# EAGLE schematic control (EAGLE 9.6.2)

## Sheet 1 of 3: COVER
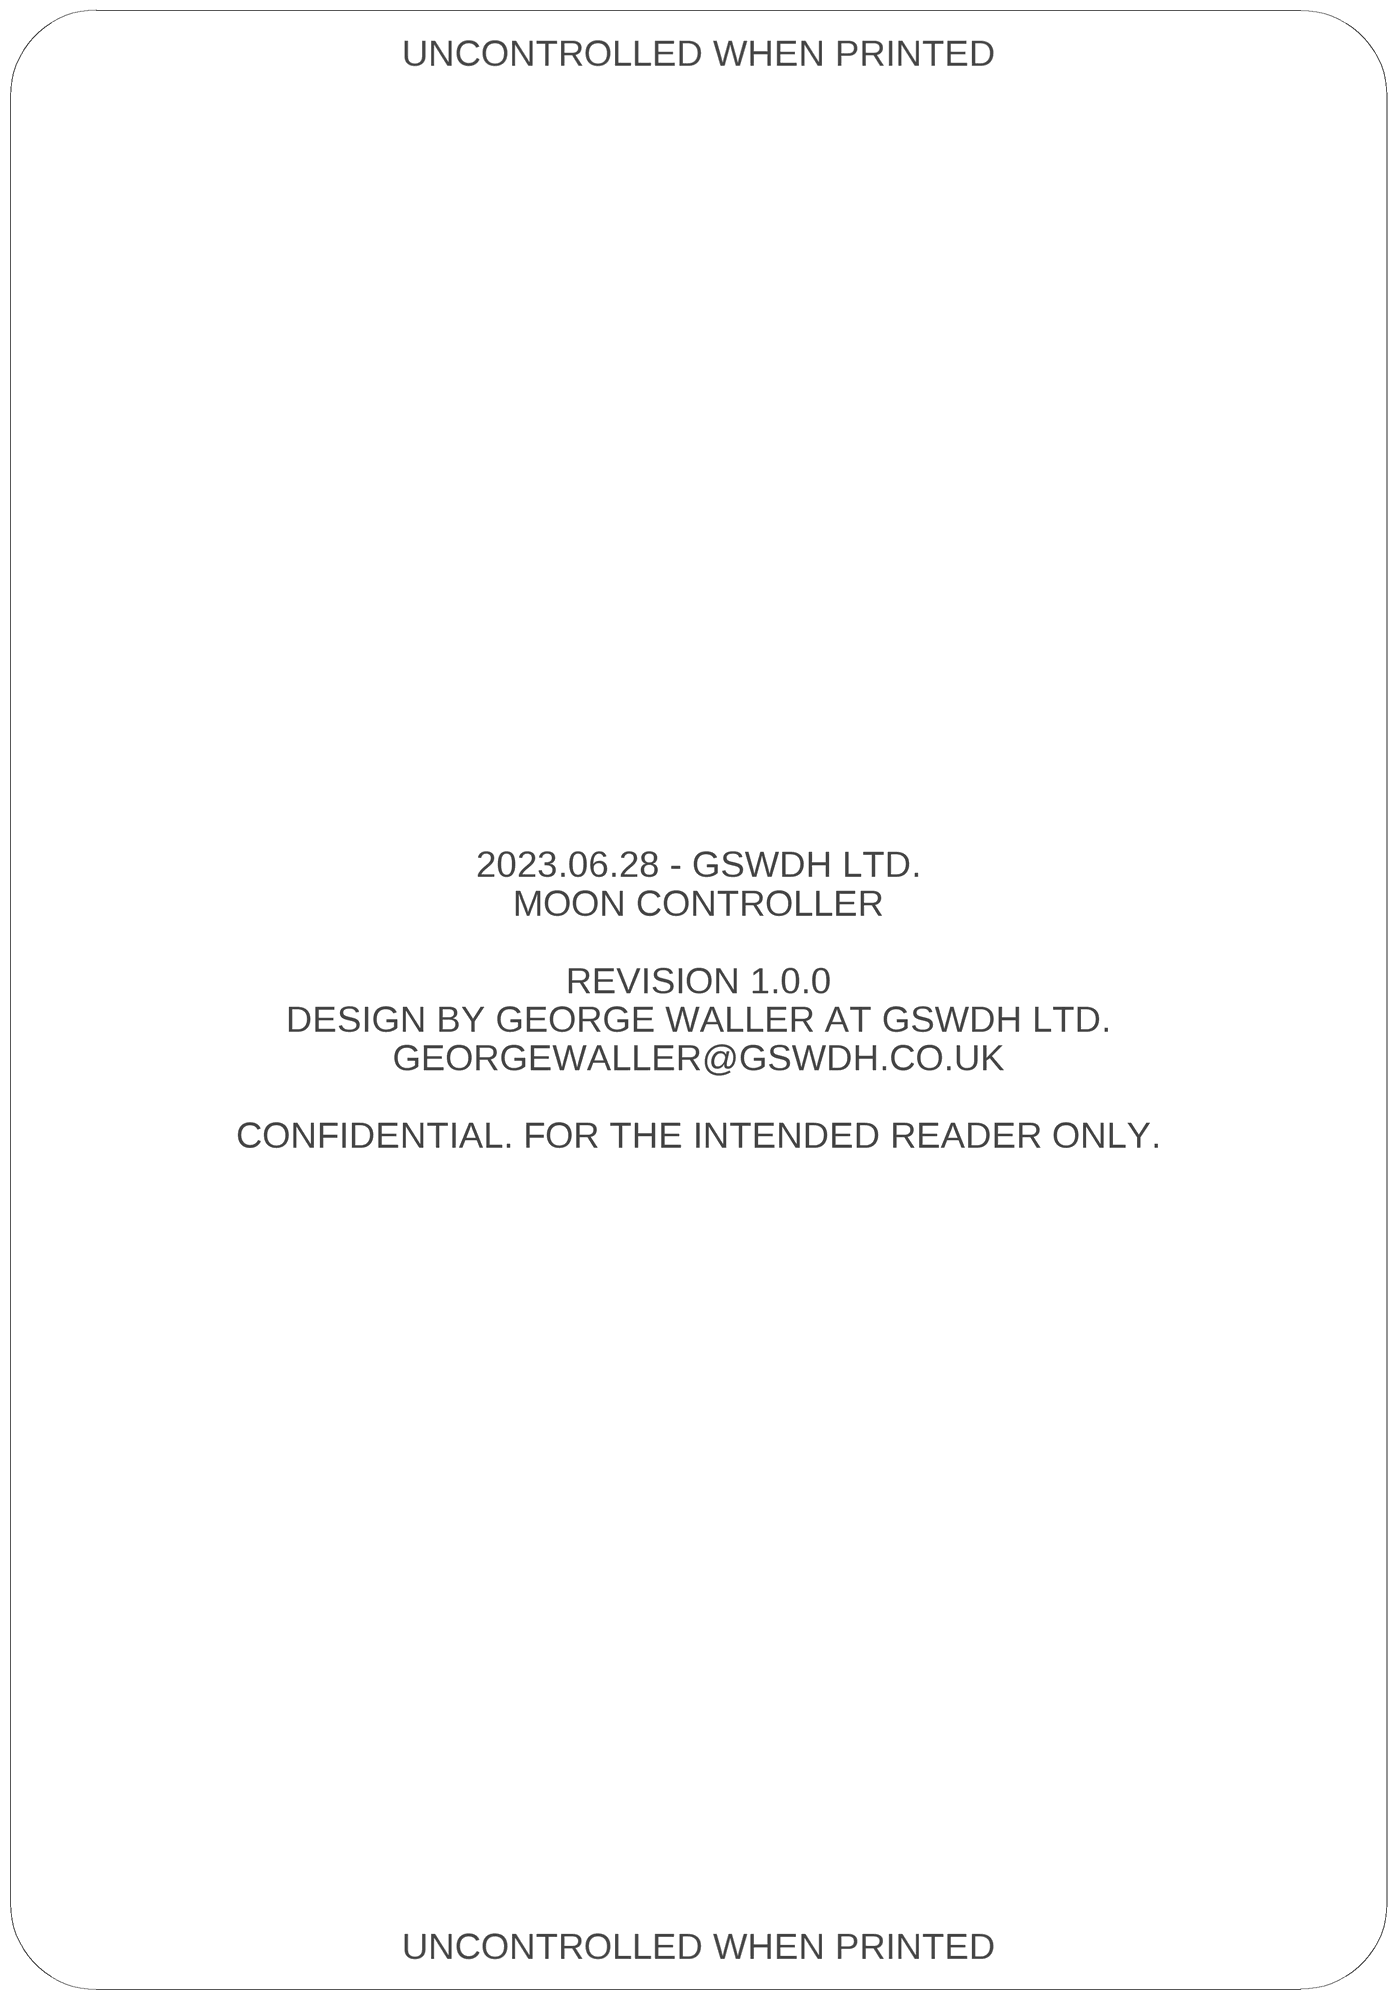
[diagram p0: schematic, sheet 1]

### Notes on the sheet
- UNCONTROLLED WHEN PRINTED
- 2023.06.28 - GSWDH LTD.
  MOON CONTROLLER
  
  REVISION 1.0.0
  DESIGN BY GEORGE WALLER AT GSWDH LTD.
  GEORGEWALLER@GSWDH.CO.UK
  
  CONFIDENTIAL. FOR THE INTENDED READER ONLY.
- UNCONTROLLED WHEN PRINTED

## Sheet 2 of 3: FPGA
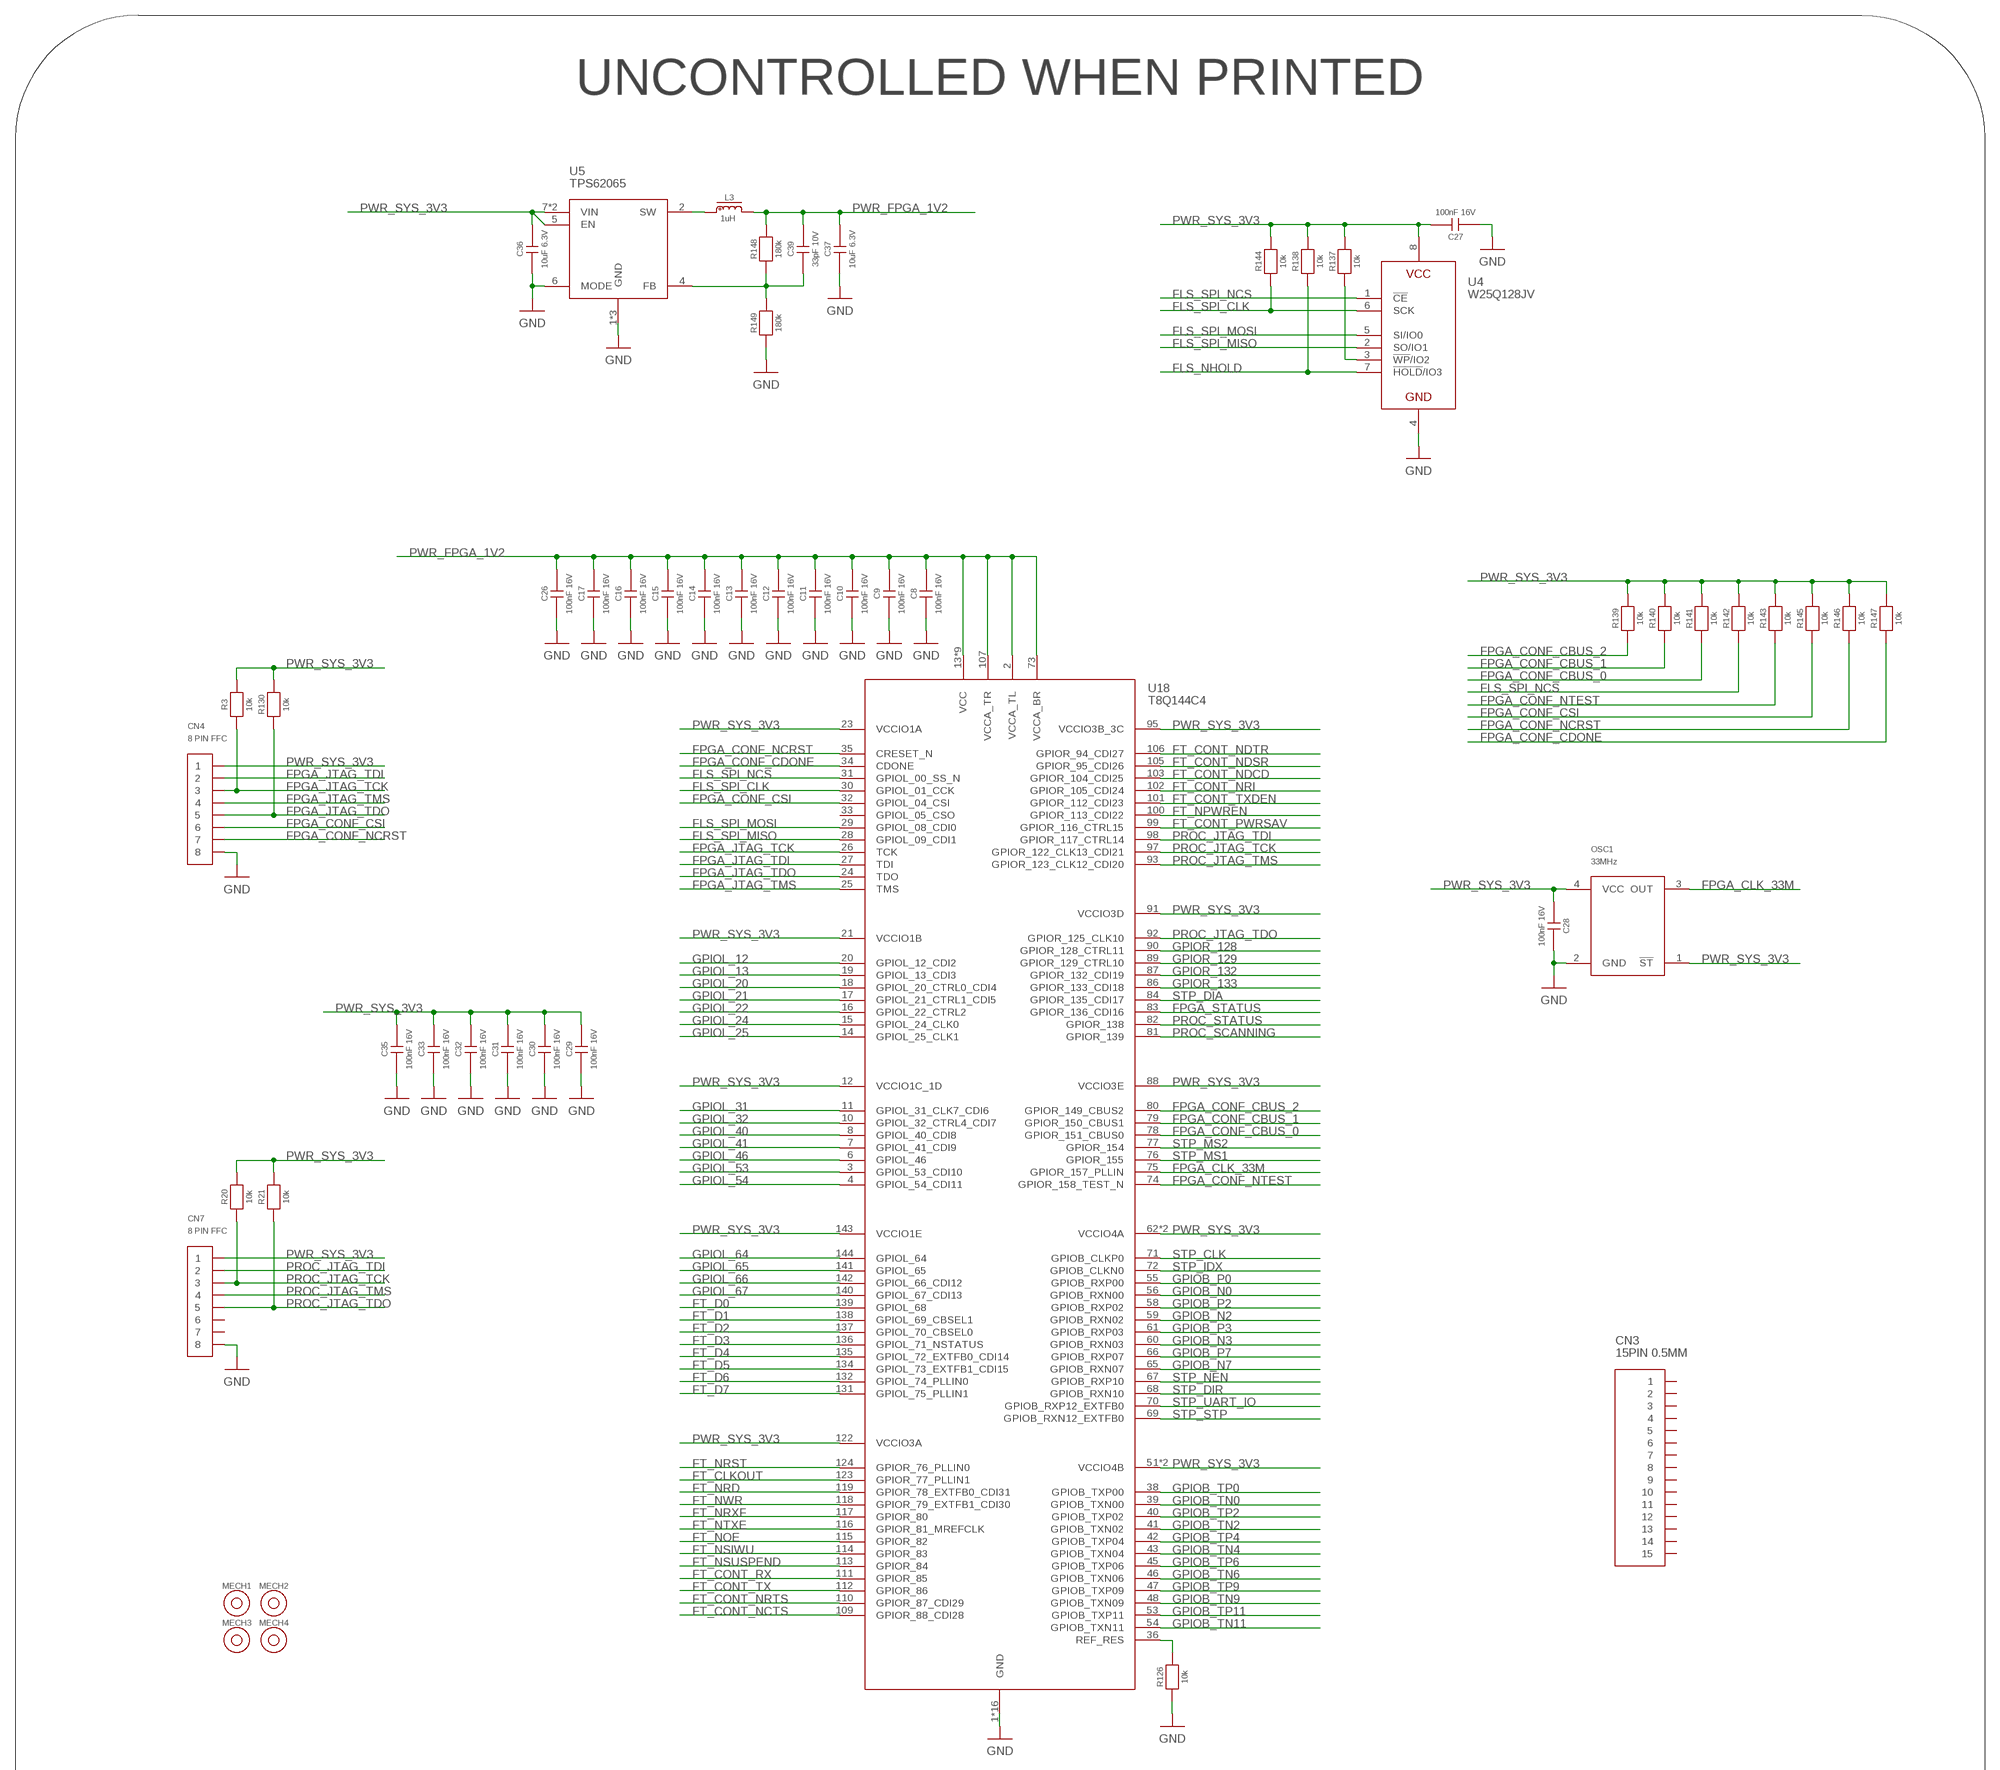
[diagram p1: schematic, sheet 2, part 1 of 2]
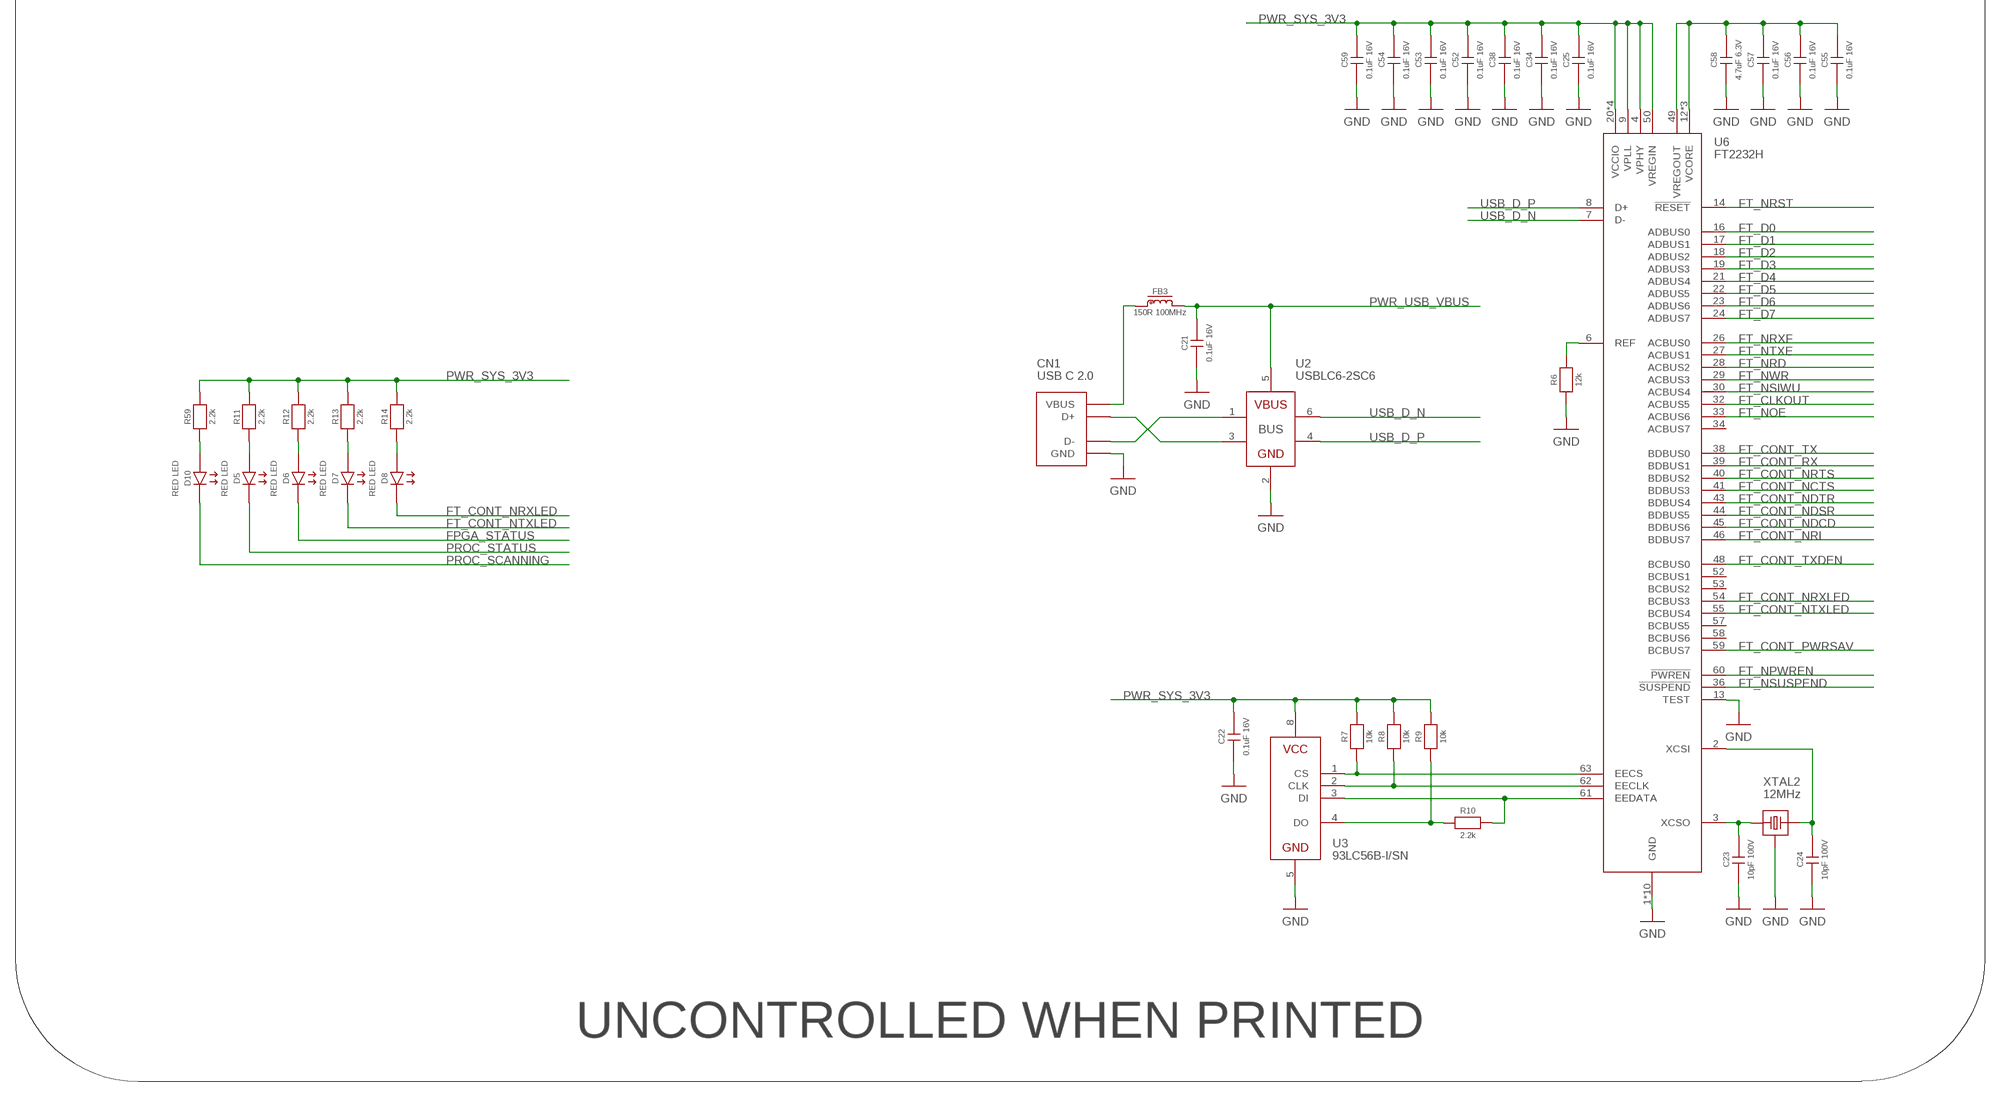
[diagram p2: schematic, sheet 2, part 2 of 2]

### Parts
C8  100nF 16V  CL10B104KO8WPNC  [0603]
C9  100nF 16V  CL10B104KO8WPNC  [0603]
C10  100nF 16V  CL10B104KO8WPNC  [0603]
C11  100nF 16V  CL10B104KO8WPNC  [0603]
C12  100nF 16V  CL10B104KO8WPNC  [0603]
C13  100nF 16V  CL10B104KO8WPNC  [0603]
C14  100nF 16V  CL10B104KO8WPNC  [0603]
C15  100nF 16V  CL10B104KO8WPNC  [0603]
C16  100nF 16V  CL10B104KO8WPNC  [0603]
C17  100nF 16V  CL10B104KO8WPNC  [0603]
C21  0.1uF 16V  0603YC104JAZ2A  [0603]
C22  0.1uF 16V  0603YC104JAZ2A  [0603]
C23  10pF 100V  06031A100B4T2A  [0603]
C24  10pF 100V  06031A100B4T2A  [0603]
C25  0.1uF 16V  0603YC104JAZ2A  [0603]
C26  100nF 16V  CL10B104KO8WPNC  [0603]
C27  100nF 16V  CL10B104KO8WPNC  [0603]
C28  100nF 16V  CL10B104KO8WPNC  [0603]
C29  100nF 16V  CL10B104KO8WPNC  [0603]
C30  100nF 16V  CL10B104KO8WPNC  [0603]
C31  100nF 16V  CL10B104KO8WPNC  [0603]
C32  100nF 16V  CL10B104KO8WPNC  [0603]
C33  100nF 16V  CL10B104KO8WPNC  [0603]
C34  0.1uF 16V  0603YC104JAZ2A  [0603]
C35  100nF 16V  CL10B104KO8WPNC  [0603]
C36  10uF 6.3V  CL10A106KQ8NNWC  [0603]
C37  10uF 6.3V  CL10A106KQ8NNWC  [0603]
C38  0.1uF 16V  0603YC104JAZ2A  [0603]
C39  33pF 10V  C0603C330J8GAC7867  [0603]
C52  0.1uF 16V  0603YC104JAZ2A  [0603]
C53  0.1uF 16V  0603YC104JAZ2A  [0603]
C54  0.1uF 16V  0603YC104JAZ2A  [0603]
C55  0.1uF 16V  0603YC104JAZ2A  [0603]
C56  0.1uF 16V  0603YC104JAZ2A  [0603]
C57  0.1uF 16V  0603YC104JAZ2A  [0603]
C58  4.7uF 6.3V  06036D475KAT4A  [0603]
C59  0.1uF 16V  0603YC104JAZ2A  [0603]
CN1  USB C 2.0  MC-107D  [MC-107D]
CN3  15PIN 0.5MM  SFV15R-1STE1HLF  [SFV15R-1STE1HLF]
CN4  8 PIN FFC  SFV8R-1STBE1HLF  [SFV8R-1STBE1HLF]
CN7  8 PIN FFC  SFV8R-1STBE1HLF  [SFV8R-1STBE1HLF]
D5  RED LED  150060RS75000  [0603_POLAR]
D6  RED LED  150060RS75000  [0603_POLAR]
D7  RED LED  150060RS75000  [0603_POLAR]
D8  RED LED  150060RS75000  [0603_POLAR]
D10  RED LED  150060RS75000  [0603_POLAR]
FB3  150R 100MHz  ILB1206ER151V  [1206]
L3  1uH  CIGT252010EH1R0MNE  [1008]
MECH1  6mm x 3mm  MOUNTHOLE  [MOUNTHOLE_6X3]
MECH2  6mm x 3mm  MOUNTHOLE  [MOUNTHOLE_6X3]
MECH3  6mm x 3mm  MOUNTHOLE  [MOUNTHOLE_6X3]
MECH4  6mm x 3mm  MOUNTHOLE  [MOUNTHOLE_6X3]
OSC1  33MHz  KC2016Z33.0000C15XXK  [KC2016Z]
R3  10k  ERJ3EKF1002V  [0603]
R6  12k  CRCW060312K0FKEA  [0603]
R7  10k  ERJ3EKF1002V  [0603]
R8  10k  ERJ3EKF1002V  [0603]
R9  10k  ERJ3EKF1002V  [0603]
R10  2.2k  CRCW06032K20FKEA  [0603]
R11  2.2k  CRCW06032K20FKEA  [0603]
R12  2.2k  CRCW06032K20FKEA  [0603]
R13  2.2k  CRCW06032K20FKEA  [0603]
R14  2.2k  CRCW06032K20FKEA  [0603]
R20  10k  ERJ3EKF1002V  [0603]
R21  10k  ERJ3EKF1002V  [0603]
R59  2.2k  CRCW06032K20FKEA  [0603]
R126  10k  ERJ3EKF1002V  [0603]
R130  10k  ERJ3EKF1002V  [0603]
R137  10k  ERJ3EKF1002V  [0603]
R138  10k  ERJ3EKF1002V  [0603]
R139  10k  ERJ3EKF1002V  [0603]
R140  10k  ERJ3EKF1002V  [0603]
R141  10k  ERJ3EKF1002V  [0603]
R142  10k  ERJ3EKF1002V  [0603]
R143  10k  ERJ3EKF1002V  [0603]
R144  10k  ERJ3EKF1002V  [0603]
R145  10k  ERJ3EKF1002V  [0603]
R146  10k  ERJ3EKF1002V  [0603]
R147  10k  ERJ3EKF1002V  [0603]
R148  180k  CRCW0603180KFKEA  [0603]
R149  180k  CRCW0603180KFKEA  [0603]
U2  USBLC6-2SC6  [SOT23-6]
U3  93LC56B-I/SN  [SO8]
U4  W25Q128JV  W25Q128JVSIQ  [SO8-208MIL]
U5  TPS62065  TPS62065DSGR  [WSON8]
U6  FT2232H  [QFN64]
U18  T8Q144C4  [QFP144]
XTAL2  12MHz  ABM8-12.000MHZ-B2-T  [3.2X3.5SMD]

### Nets
FLS_NHOLD: R138.1 U4.7(!HOLD!/IO3)
FLS_SPI_CLK: R144.1 U4.6(SCK) U18.30(GPIOL_01_CCK)
FLS_SPI_MISO: U4.2(SO/IO1) U18.28(GPIOL_09_CDI1)
FLS_SPI_MOSI: U4.5(SI/IO0) U18.29(GPIOL_08_CDI0)
FLS_SPI_NCS: R142.1 U4.1(!CE) U18.31(GPIOL_00_SS_N)
FPGA_CLK_33M: OSC1.3(OUT) U18.75(GPIOR_157_PLLIN)
FPGA_CONF_CBUS_0: R141.1 U18.78(GPIOR_151_CBUS0)
FPGA_CONF_CBUS_1: R140.1 U18.79(GPIOR_150_CBUS1)
FPGA_CONF_CBUS_2: R139.1 U18.80(GPIOR_149_CBUS2)
FPGA_CONF_CDONE: R147.1 U18.34(CDONE)
FPGA_CONF_CSI: CN4.6 R145.1 U18.32(GPIOL_04_CSI)
FPGA_CONF_NCRST: CN4.7 R146.1 U18.35(CRESET_N)
FPGA_CONF_NTEST: R143.1 U18.74(GPIOR_158_TEST_N)
FPGA_JTAG_TCK: CN4.3 R3.1 U18.26(TCK)
FPGA_JTAG_TDI: CN4.2 U18.27(TDI)
FPGA_JTAG_TDO: CN4.5 R130.1 U18.24(TDO)
FPGA_JTAG_TMS: CN4.4 U18.25(TMS)
FPGA_STATUS: D6.K U18.83(GPIOR_136_CDI16)
FT_CLKOUT: U6.32(ACBUS5) U18.123(GPIOR_77_PLLIN1)
FT_CONT_NCTS: U6.41(BDBUS3) U18.109(GPIOR_88_CDI28)
FT_CONT_NDCD: U6.45(BDBUS6) U18.103(GPIOR_104_CDI25)
FT_CONT_NDSR: U6.44(BDBUS5) U18.105(GPIOR_95_CDI26)
FT_CONT_NDTR: U6.43(BDBUS4) U18.106(GPIOR_94_CDI27)
FT_CONT_NRI: U6.46(BDBUS7) U18.102(GPIOR_105_CDI24)
FT_CONT_NRTS: U6.40(BDBUS2) U18.110(GPIOR_87_CDI29)
FT_CONT_NRXLED: D8.K U6.54(BCBUS3)
FT_CONT_NTXLED: D7.K U6.55(BCBUS4)
FT_CONT_PWRSAV: U6.59(BCBUS7) U18.99(GPIOR_116_CTRL15)
FT_CONT_RX: U6.39(BDBUS1) U18.111(GPIOR_85)
FT_CONT_TX: U6.38(BDBUS0) U18.112(GPIOR_86)
FT_CONT_TXDEN: U6.48(BCBUS0) U18.101(GPIOR_112_CDI23)
FT_D0: U6.16(ADBUS0) U18.139(GPIOL_68)
FT_D1: U6.17(ADBUS1) U18.138(GPIOL_69_CBSEL1)
FT_D2: U6.18(ADBUS2) U18.137(GPIOL_70_CBSEL0)
FT_D3: U6.19(ADBUS3) U18.136(GPIOL_71_NSTATUS)
FT_D4: U6.21(ADBUS4) U18.135(GPIOL_72_EXTFB0_CDI14)
FT_D5: U6.22(ADBUS5) U18.134(GPIOL_73_EXTFB1_CDI15)
FT_D6: U6.23(ADBUS6) U18.132(GPIOL_74_PLLIN0)
FT_D7: U6.24(ADBUS7) U18.131(GPIOL_75_PLLIN1)
FT_NOE: U6.33(ACBUS6) U18.115(GPIOR_82)
FT_NPWREN: U6.60(!PWREN) U18.100(GPIOR_113_CDI22)
FT_NRD: U6.28(ACBUS2) U18.119(GPIOR_78_EXTFB0_CDI31)
FT_NRST: U6.14(!RESET) U18.124(GPIOR_76_PLLIN0)
FT_NRXF: U6.26(ACBUS0) U18.117(GPIOR_80)
FT_NSIWU: U6.30(ACBUS4) U18.114(GPIOR_83)
FT_NSUSPEND: U6.36(!SUSPEND) U18.113(GPIOR_84)
FT_NTXE: U6.27(ACBUS1) U18.116(GPIOR_81_MREFCLK)
FT_NWR: U6.29(ACBUS3) U18.118(GPIOR_79_EXTFB1_CDI30)
GND: C8.1 C9.1 C10.1 C11.1 C12.1 C13.1 C14.1 C15.1 C16.1 C17.1 C21.1 C22.1 C23.1 C24.1 C25.1 C26.1 C27.1 C28.2 C29.1 C30.1 C31.1 C32.1 C33.1 C34.1 C35.1 C36.1 C37.1 C38.1 C52.1 C53.1 C54.1 C55.1 C56.1 C57.1 C58.1 C59.1 CN1.A12B1(GND) CN1.B12A1(GND) CN1.P$1(GND) CN1.P$2(GND) CN1.P$3(GND) CN1.P$4(GND) CN1.P$5(GND) CN1.P$6(GND) CN1.P$7(GND) CN1.P$8(GND) CN1.P$9(GND) CN1.P$10(GND) CN1.P$11(GND) CN1.P$12(GND) CN1.P$13(GND) CN1.P$14(GND) CN1.P$15(GND) CN1.P$16(GND) CN1.P$17(GND) CN1.P$18(GND) CN1.P$19(GND) CN1.P$20(GND) CN1.P$21(GND) CN1.P$22(GND) CN1.P$23(GND) CN1.P$24(GND) CN4.8 CN7.8 OSC1.2(GND) R6.1 R126.1 R149.1 U2.2(GND) U3.5(GND) U4.4(GND) U5.1(GND) U5.3(GND) U5.6(MODE) U5.PAD(GND) U6.1(GND) U6.5(GND) U6.10(GND) U6.11(GND) U6.13(TEST) U6.15(GND) U6.25(GND) U6.35(GND) U6.47(GND) U6.51(GND) U6.PAD(GND) U18.1(GND) U18.5(GND) U18.9(GND) U18.37(GND) U18.44(GND) U18.50(GND) U18.64(GND) U18.94(GND) U18.104(GND) U18.108(GND) U18.120(GND) U18.121(GND) U18.126(GND) U18.127(GND) U18.129(GND) U18.133(GND) XTAL2.2(GND) XTAL2.4(GND) ; also sheet 3
GPIOB_N0: U18.56(GPIOB_RXN00)
GPIOB_N2: U18.59(GPIOB_RXN02)
GPIOB_N3: U18.60(GPIOB_RXN03)
GPIOB_N7: U18.65(GPIOB_RXN07)
GPIOB_P0: U18.55(GPIOB_RXP00)
GPIOB_P2: U18.58(GPIOB_RXP02)
GPIOB_P3: U18.61(GPIOB_RXP03)
GPIOB_P7: U18.66(GPIOB_RXP07)
GPIOB_TN0: U18.39(GPIOB_TXN00)
GPIOB_TN2: U18.41(GPIOB_TXN02)
GPIOB_TN4: U18.43(GPIOB_TXN04)
GPIOB_TN6: U18.46(GPIOB_TXN06)
GPIOB_TN9: U18.48(GPIOB_TXN09)
GPIOB_TN11: U18.54(GPIOB_TXN11)
GPIOB_TP0: U18.38(GPIOB_TXP00)
GPIOB_TP2: U18.40(GPIOB_TXP02)
GPIOB_TP4: U18.42(GPIOB_TXP04)
GPIOB_TP6: U18.45(GPIOB_TXP06)
GPIOB_TP9: U18.47(GPIOB_TXP09)
GPIOB_TP11: U18.53(GPIOB_TXP11)
GPIOL_12: U18.20(GPIOL_12_CDI2)
GPIOL_13: U18.19(GPIOL_13_CDI3)
GPIOL_20: U18.18(GPIOL_20_CTRL0_CDI4)
GPIOL_21: U18.17(GPIOL_21_CTRL1_CDI5)
GPIOL_22: U18.16(GPIOL_22_CTRL2)
GPIOL_24: U18.15(GPIOL_24_CLK0)
GPIOL_25: U18.14(GPIOL_25_CLK1)
GPIOL_31: U18.11(GPIOL_31_CLK7_CDI6)
GPIOL_32: U18.10(GPIOL_32_CTRL4_CDI7)
GPIOL_40: U18.8(GPIOL_40_CDI8)
GPIOL_41: U18.7(GPIOL_41_CDI9)
GPIOL_46: U18.6(GPIOL_46)
GPIOL_53: U18.3(GPIOL_53_CDI10)
GPIOL_54: U18.4(GPIOL_54_CDI11)
GPIOL_64: U18.144(GPIOL_64)
GPIOL_65: U18.141(GPIOL_65)
GPIOL_66: U18.142(GPIOL_66_CDI12)
GPIOL_67: U18.140(GPIOL_67_CDI13)
GPIOR_128: U18.90(GPIOR_128_CTRL11)
GPIOR_129: U18.89(GPIOR_129_CTRL10)
GPIOR_132: U18.87(GPIOR_132_CDI19)
GPIOR_133: U18.86(GPIOR_133_CDI18)
N$3: L3.1 U5.2(SW)
N$4: C39.1 R148.1 R149.2 U5.4(FB)
N$8: R137.1 U4.3(!WP!/IO2)
N$12: CN1.A6(D+) CN1.B6(D+) U2.3(D-_IN)
N$13: CN1.A7(D-) CN1.B7(D-) U2.1(D+_IN)
N$14: D5.A R11.1
N$15: D6.A R12.1
N$16: D7.A R13.1
N$17: D8.A R14.1
N$41: CN1.A9B4(VBUS) CN1.B9A4(VBUS) FB3.1
N$42: R6.2 U6.6(REF)
N$43: R7.1 U3.1(CS) U6.63(EECS)
N$44: R8.1 U3.2(CLK) U6.62(EECLK)
N$45: R10.2 U3.3(DI) U6.61(EEDATA)
N$46: R9.1 R10.1 U3.4(DO)
N$49: C23.2 U6.3(XCSO) XTAL2.3
N$50: C24.2 U6.2(XCSI) XTAL2.1
N$51: C55.2 C56.2 C57.2 C58.2 U6.12(VCORE) U6.37(VCORE) U6.49(VREGOUT) U6.64(VCORE)
N$113: D10.A R59.1
N$145: R126.2 U18.36(REF_RES)
PROC_JTAG_TCK: CN7.3 R20.1 U18.97(GPIOR_122_CLK13_CDI21)
PROC_JTAG_TDI: CN7.2 U18.98(GPIOR_117_CTRL14)
PROC_JTAG_TDO: CN7.5 R21.1 U18.92(GPIOR_125_CLK10)
PROC_JTAG_TMS: CN7.4 U18.93(GPIOR_123_CLK12_CDI20)
PROC_SCANNING: D10.K U18.81(GPIOR_139)
PROC_STATUS: D5.K U18.82(GPIOR_138)
PWR_FPGA_1V2: C8.2 C9.2 C10.2 C11.2 C12.2 C13.2 C14.2 C15.2 C16.2 C17.2 C26.2 C37.2 C39.2 L3.2 R148.2 U18.2(VCCA_TL) U18.13(VCC) U18.22(VCC) U18.49(VCC) U18.57(VCC) U18.73(VCCA_BR) U18.85(VCC) U18.96(VCC) U18.107(VCCA_TR) U18.125(VCC) U18.128(VCC) U18.130(VCC)
PWR_SYS_3V3: C22.2 C25.2 C27.2 C28.1 C29.2 C30.2 C31.2 C32.2 C33.2 C34.2 C35.2 C36.2 C38.2 C52.2 C53.2 C54.2 C59.2 CN4.1 CN7.1 OSC1.1(!ST) OSC1.4(VCC) R3.2 R7.2 R8.2 R9.2 R11.2 R12.2 R13.2 R14.2 R20.2 R21.2 R59.2 R130.2 R137.2 R138.2 R139.2 R140.2 R141.2 R142.2 R143.2 R144.2 R145.2 R146.2 R147.2 U3.8(V+) U4.8(VCC) U5.5(EN) U5.7(VIN) U5.8(VIN) U6.4(VPHY) U6.9(VPLL) U6.20(VCCIO) U6.31(VCCIO) U6.42(VCCIO) U6.50(VREGIN) U6.56(VCCIO) U18.12(VCCIO1C_1D) U18.21(VCCIO1B) U18.23(VCCIO1A) U18.51(VCCIO4B) U18.52(VCCIO4B) U18.62(VCCIO4A) U18.63(VCCIO4A) U18.88(VCCIO3E) U18.91(VCCIO3D) U18.95(VCCIO3B_3C) U18.122(VCCIO3A) U18.143(VCCIO1E) ; also sheet 3
PWR_USB_VBUS: C21.2 FB3.2 U2.5(VBUS)
STP_CLK: U18.71(GPIOB_CLKP0) ; also sheet 3
STP_DIA: U18.84(GPIOR_135_CDI17) ; also sheet 3
STP_DIR: U18.68(GPIOB_RXN10) ; also sheet 3
STP_IDX: U18.72(GPIOB_CLKN0) ; also sheet 3
STP_MS1: U18.76(GPIOR_155) ; also sheet 3
STP_MS2: U18.77(GPIOR_154) ; also sheet 3
STP_NEN: U18.67(GPIOB_RXP10) ; also sheet 3
STP_STP: U18.69(GPIOB_RXN12_EXTFB0) ; also sheet 3
STP_UART_IO: U18.70(GPIOB_RXP12_EXTFB0) ; also sheet 3
USB_D_N: U2.6(D+_OUT) U6.7(D-)
USB_D_P: U2.4(D-OUT) U6.8(D+)
Unconnected: CN3.1 CN3.2 CN3.3 CN3.4 CN3.5 CN3.6 CN3.7 CN3.8 CN3.9 CN3.10 CN3.11 CN3.12 CN3.13 CN3.14 CN3.15 CN7.6 CN7.7 U6.34(ACBUS7) U6.52(BCBUS1) U6.53(BCBUS2) U6.57(BCBUS5) U6.58(BCBUS6) U18.33(GPIOL_05_CSO)

### Notes on the sheet
- UNCONTROLLED WHEN PRINTED
- UNCONTROLLED WHEN PRINTED

## Sheet 3 of 3: POWER
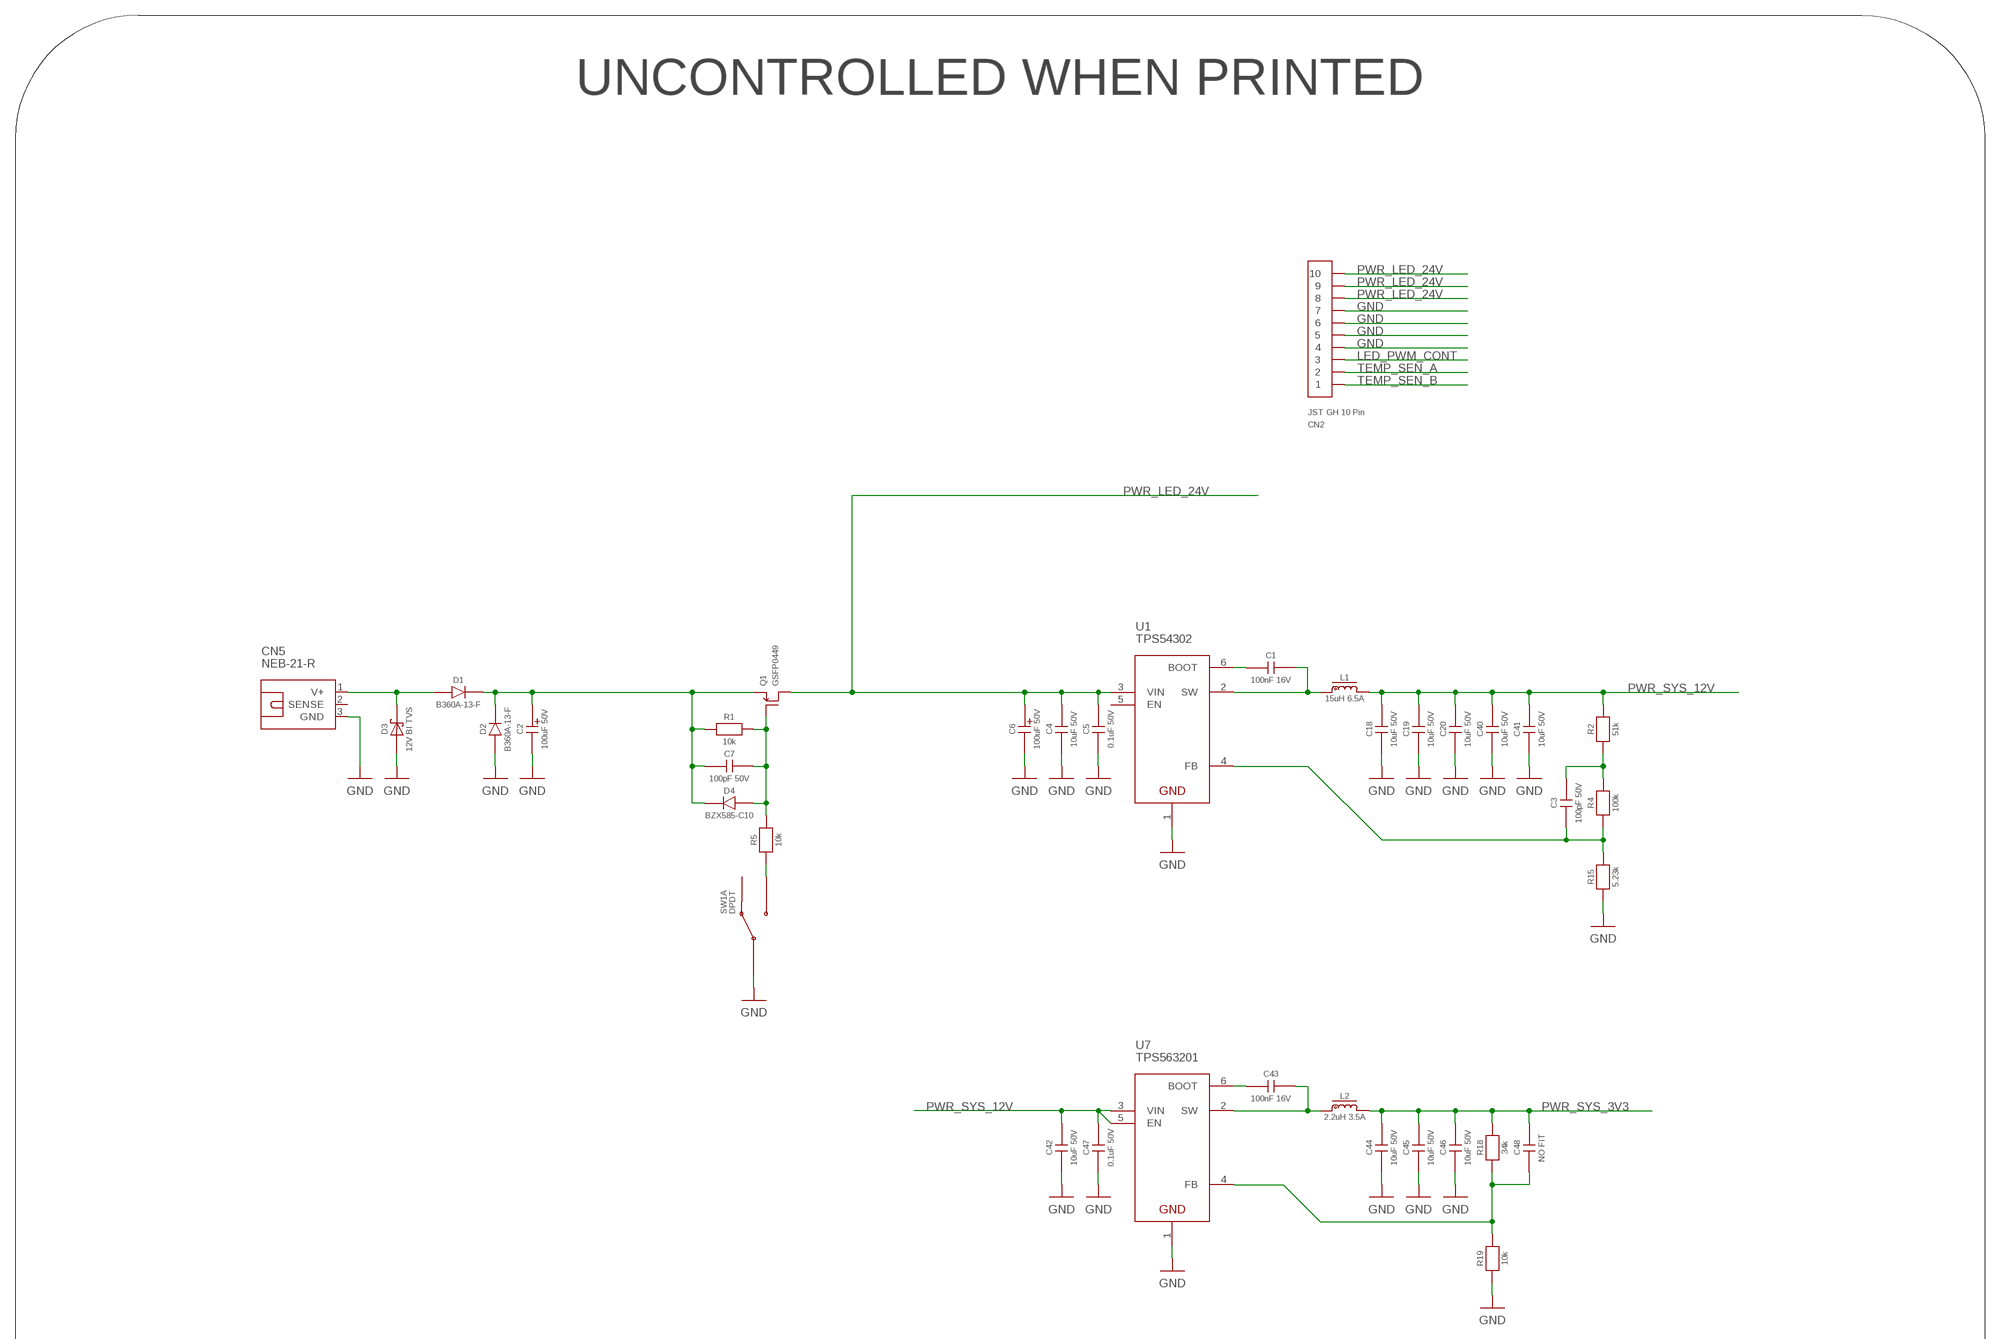
[diagram p3: schematic, sheet 3, part 1 of 2]
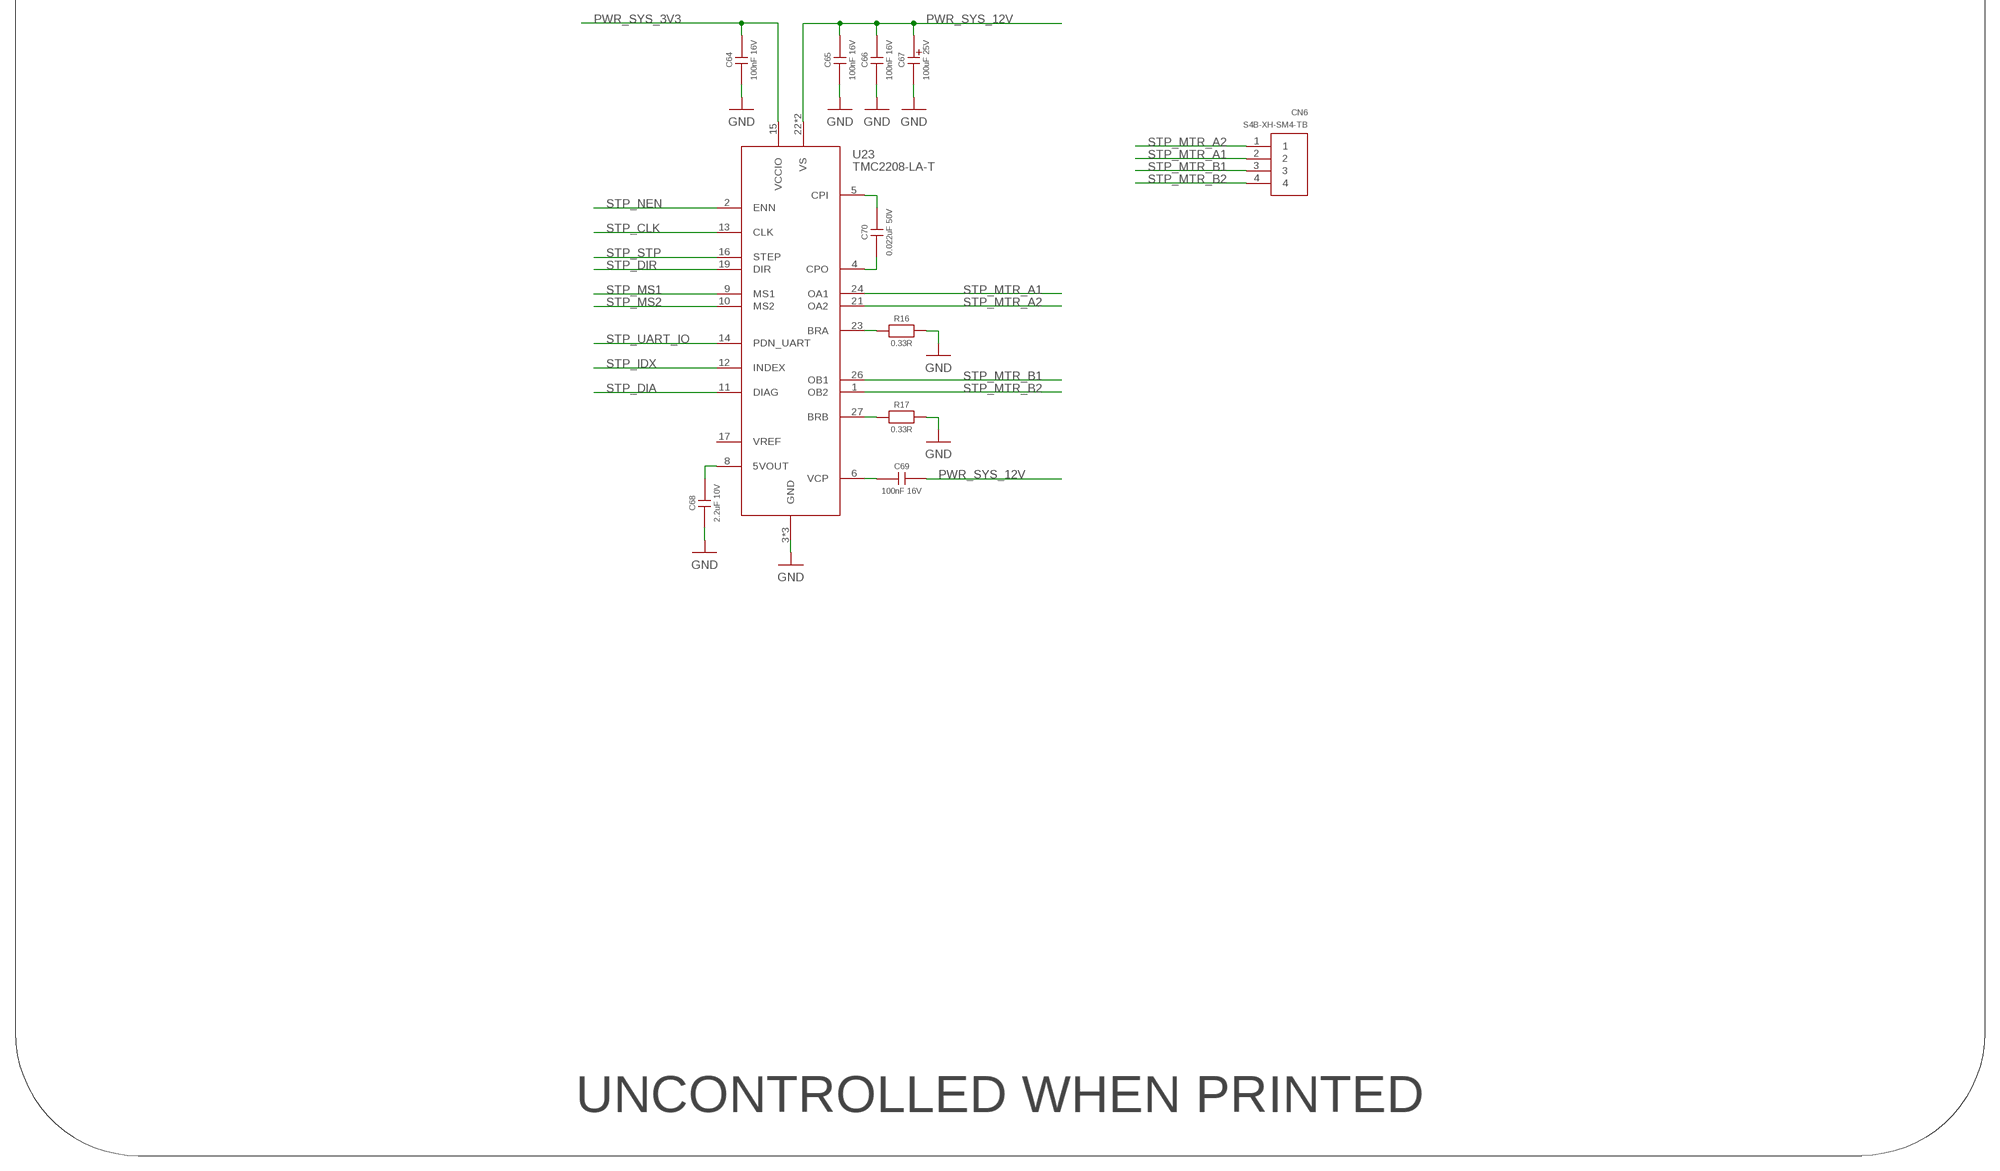
[diagram p4: schematic, sheet 3, part 2 of 2]

### Parts
C1  100nF 16V  CL10B104KO8WPNC  [0603]
C2  100uF 50V  107CKR050M  [8MM_RADIAL_3.5MM_PITCH]
C3  100pF 50V  06035A101J4T4A  [0603]
C4  10uF 50V  C3225X7S1H106M250AB  [1210]
C5  0.1uF 50V  06035C104JAT2A  [0603]
C6  100uF 50V  107CKR050M  [8MM_RADIAL_3.5MM_PITCH]
C7  100pF 50V  06035A101J4T4A  [0603]
C18  10uF 50V  CL21A106KAYNNNE  [0805]
C19  10uF 50V  CL21A106KAYNNNE  [0805]
C20  10uF 50V  CL21A106KAYNNNE  [0805]
C40  10uF 50V  CL21A106KAYNNNE  [0805]
C41  10uF 50V  CL21A106KAYNNNE  [0805]
C42  10uF 50V  CL21A106KAYNNNE  [0805]
C43  100nF 16V  CL10B104KO8WPNC  [0603]
C44  10uF 50V  CL21A106KAYNNNE  [0805]
C45  10uF 50V  CL21A106KAYNNNE  [0805]
C46  10uF 50V  CL21A106KAYNNNE  [0805]
C47  0.1uF 50V  06035C104JAT2A  [0603]
C48  NO FIT  06035A101J4T4A  [0603]
C64  100nF 16V  CL10B104KO8WPNC  [0603]
C65  100nF 16V  CL10B104KO8WPNC  [0603]
C66  100nF 16V  CL10B104KO8WPNC  [0603]
C67  100uF 25V  UVY1E101MDD  [5MM_RADIAL_2MM_PITCH]
C68  2.2uF 10V  0603ZC225KAT2A  [0603]
C69  100nF 16V  CL10B104KO8WPNC  [0603]
C70  0.022uF 50V  C0603C223K5REC7867  [0603]
CN2  JST GH 10 Pin  1.25-10PWT  [1.25-10PWT]
CN5  NEB-21-R  [NEB-21-R]
CN6  S4B-XH-SM4-TB  [S4B-XH-SM4-TB]
D1  B360A-13-F  [DO214AC]
D2  B360A-13-F  [DO214AC]
D3  12V BI TVS  SMBJ12CA-13-F  [DO214AC]
D4  BZX585-C10  BZT52C10T-7  [SOD_523]
L1  15uH 6.5A  MWSA1004S-150MT  [SRP1035A]
L2  2.2uH 3.5A  SRN5040-2R2Y  [SRN5040]
Q1  GSFP0449  [SO8_POWERPAK]
R1  10k  CRCW060310K0FKTA  [0603]
R2  51k  CRCW060351K0FKEA  [0603]
R4  100k  CRCW0603100KFKEB  [0603]
R5  10k  CRCW060310K0FKTA  [0603]
R15  5.23k  CRCW06035K23FKEA  [0603]
R16  0.33R  CRL0603-FW-R330ELF  [0603]
R17  0.33R  CRL0603-FW-R330ELF  [0603]
R18  34k  CRCW060334K0FKEA  [0603]
R19  10k  CRCW060310K0FKTA  [0603]
SW1  DPDT  PBH2UEESNPNAGX  [PBH2UEESNPNAGX]
U1  TPS54302  [SOT23-6]
U7  TPS563201  TPS563201DDCR  [SOT23-6]
U23  TMC2208-LA-T  [QFN28]

### Nets
GND: C2.N(K) C4.1 C5.1 C6.N(K) C18.1 C19.1 C20.1 C40.1 C41.1 C42.1 C44.1 C45.1 C46.1 C47.1 C64.1 C65.1 C66.1 C67.2(K) C68.1 CN2.4 CN2.5 CN2.6 CN2.7 CN5.3(GND) D2.A D3.A R15.1 R16.2 R17.2 R19.1 SW1.2 U1.1(GND) U7.1(GND) U23.3(GND) U23.18(GND) U23.29(GND) ; also sheet 2
LED_PWM_CONT: CN2.3
N$1: C7.2 D4.A Q1.4(G) R1.2 R5.2
N$2: C1.1 U1.6(BOOT)
N$5: CN5.1(V+) D1.A D3.K
N$6: C1.2 L1.1 U1.2(SW)
N$7: C3.2 R2.1 R4.2
N$9: C3.1 R4.1 R15.2 U1.4(FB)
N$10: C43.1 U7.6(BOOT)
N$11: R5.1 SW1.3
N$18: C68.2 U23.8(5VOUT)
N$19: C2.P(A) C7.1 D1.K D2.K D4.K Q1.1(S) Q1.2(S) Q1.3(S) R1.1
N$20: C43.2 L2.1 U7.2(SW)
N$24: C69.1 U23.6(VCP)
N$25: C48.1 R18.1 R19.2 U7.4(FB)
N$37: C70.2 U23.5(CPI)
N$38: C70.1 U23.4(CPO)
N$47: R16.1 U23.23(BRA)
N$48: R17.1 U23.27(BRB)
PWR_LED_24V: C4.2 C5.2 C6.P(A) CN2.8 CN2.9 CN2.10 Q1.5(D) Q1.6(D) Q1.7(D) Q1.8(D) Q1.PAD(D) U1.3(VIN)
PWR_SYS_3V3: C44.2 C45.2 C46.2 C48.2 C64.2 L2.2 R18.2 U23.15(VCCIO) ; also sheet 2
PWR_SYS_12V: C18.2 C19.2 C20.2 C40.2 C41.2 C42.2 C47.2 C65.2 C66.2 C67.1(A) C69.2 L1.2 R2.2 U7.3(VIN) U7.5(EN) U23.22(VS) U23.28(VS)
STP_CLK: U23.13(CLK) ; also sheet 2
STP_DIA: U23.11(DIAG) ; also sheet 2
STP_DIR: U23.19(DIR) ; also sheet 2
STP_IDX: U23.12(INDEX) ; also sheet 2
STP_MS1: U23.9(MS1) ; also sheet 2
STP_MS2: U23.10(MS2) ; also sheet 2
STP_MTR_A1: CN6.2 U23.24(OA1)
STP_MTR_A2: CN6.1 U23.21(OA2)
STP_MTR_B1: CN6.3 U23.26(OB1)
STP_MTR_B2: CN6.4 U23.1(OB2)
STP_NEN: U23.2(ENN) ; also sheet 2
STP_STP: U23.16(STEP) ; also sheet 2
STP_UART_IO: U23.14(PDN_UART) ; also sheet 2
TEMP_SEN_A: CN2.2
TEMP_SEN_B: CN2.1
Unconnected: CN5.2(SENSE) SW1.1 SW1.4 SW1.5 SW1.6 U1.5(EN) U23.17(VREF)

### Notes on the sheet
- UNCONTROLLED WHEN PRINTED
- UNCONTROLLED WHEN PRINTED

## Library data of the parts
C1 C8-C17 C26-C33 C35 C43 C64-C66 C69 = CAPACITORS:CL10B104KO8WPNC: 100nF 16V X7R 10% 0603 MLCC; DIGIKEY: 1276-6582-1-ND; HEIGHT: 1; PRICE_PER: 0.08
C2 C6 = CAPACITORS:107CKR050M: 100uF 50V Electrolytic 20% 8mm radial.; DIGIKEY: 1572-1044-ND; HEIGHT: 14; PRICE_PER: 0.223
C3 C7 = c_0603:06035A101J4T4A: 100 50V 100pF ±5% C0G, NP0 0603; DIGIKEY: 478-06035A101J4T4ACT-ND; HEIGHT: -; MANUFACTURER: AVX Corporation; PRICE_PER: 0.13000; STOCK: 29039; TEMP_CO: C0G, NP0; TOLERANCE: ±5%; VOLTAGE: 50V
C4 = CAPACITORS:C3225X7S1H106M250AB: 10uF 50V X7S 20% 1210 MLCC.; DIGIKEY: 445-4537-1-ND; HEIGHT: 3; PRICE_PER: 0.583
C5 C47 = c_0603:06035C104JAT2A: 100000 50V 0.1µF ±5% X7R 0603; DIGIKEY: 478-5778-1-ND; HEIGHT: -; MANUFACTURER: AVX Corporation; PRICE_PER: 0.07000; STOCK: 883194; TEMP_CO: X7R; TOLERANCE: ±5%; VOLTAGE: 50V
C18-C20 C40-C42 C44-C46 = CAPACITORS:CL21A106KAYNNNE: 10uF 25V X5R 10% 0805 MLCC.; HEIGHT: 3; LCSC: C15850; PRICE_PER: 0.0107
C21 C22 C25 C34 C38 C52-C57 C59 = c_0603:0603YC104JAZ2A: 100000 16V 0.1µF ±5% X7R 0603; DIGIKEY: 478-5291-1-ND; HEIGHT: -; MANUFACTURER: AVX Corporation; PRICE_PER: 0.36000; STOCK: 16376; TEMP_CO: X7R; TOLERANCE: ±5%; VOLTAGE: 16V
C23 C24 = c_0603:06031A100B4T2A: 10 100V 10pF ±0.1pF C0G, NP0 0603; DIGIKEY: 478-10183-1-ND; HEIGHT: -; MANUFACTURER: AVX Corporation; PRICE_PER: 0.36000; STOCK: 7009; TEMP_CO: C0G, NP0; TOLERANCE: ±0.1pF; VOLTAGE: 100V
C36 C37 = c_0603:CL10A106KQ8NNWC: 10000000 6.3V 10µF ±10% X5R 0603; DIGIKEY: 1276-1868-1-ND; HEIGHT: -; MANUFACTURER: Samsung Electro-Mechanics; PRICE_PER: 0.20000; STOCK: 75457; TEMP_CO: X5R; TOLERANCE: ±10%; VOLTAGE: 6.3V
C39 = c_0603:C0603C330J8GAC7867: 33 10V 33pF ±5% C0G, NP0 0603; DIGIKEY: 399-14976-1-ND; HEIGHT: -; MANUFACTURER: KEMET; PRICE_PER: 0.19000; STOCK: 4568; TEMP_CO: C0G, NP0; TOLERANCE: ±5%; VOLTAGE: 10V
C48 = c_0603:06035A101J4T4A: 100 50V 100pF ±5% C0G, NP0 0603; DIGIKEY: 478-06035A101J4T4ACT-ND; HEIGHT: -; MANUFACTURER: AVX Corporation; PRICE_PER: 0.13000; STOCK: 29039; TEMP_CO: C0G, NP0; TOLERANCE: ±5%; VALUE: 100pF 50V; VOLTAGE: 50V
C58 = c_0603:06036D475KAT4A: 4700000 6.3V 4.7µF ±10% X5R 0603; DIGIKEY: 478-10813-1-ND; HEIGHT: -; MANUFACTURER: AVX Corporation; PRICE_PER: 0.12000; STOCK: 63871; TEMP_CO: X5R; TOLERANCE: ±10%; VOLTAGE: 6.3V
C67 = CAPACITORS:UVY1E101MDD: 100uF 25V POLAR ELECTROLYTIC 20% 5MM ELEC.; DIGIKEY: UVY1E101MDD-ND; HEIGHT: 11; PRICE_PER: 0.22
C68 = c_0603:0603ZC225KAT2A: 2200000 10V 2.2µF ±10% X7R 0603; DIGIKEY: 478-11618-1-ND; HEIGHT: -; MANUFACTURER: AVX Corporation; PRICE_PER: 0.80000; STOCK: 5914; TEMP_CO: X7R; TOLERANCE: ±10%; VOLTAGE: 10V
C70 = c_0603:C0603C223K5REC7867: 22000 50V 0.022µF ±10% X7R 0603; DIGIKEY: 399-14174-1-ND; HEIGHT: -; MANUFACTURER: KEMET; PRICE_PER: 0.16000; STOCK: 12232; TEMP_CO: X7R; TOLERANCE: ±10%; VOLTAGE: 50V
CN1 = CONNECTORs:MC-107D: USB 3.1 3A 1 Surface Mount，Right Angle 16P Female -25℃~+85℃ Type-C SMD USB Connectors ROHS; HEIGHT: 3.5; LCSC: C2874568; PRICE_PER: 0.08
CN2 = CONNECTORs:1.25-10PWT: 1x10P GH 10P 1 1.25mm 10 -25℃~+85℃ 1A Surface Mount，Right Angle SMD,P=1.25mm,Surface Mount，Right Angle Wire To Board / Wire To Wire Connector ROHS; HEIGHT: 3.6; LCSC: C5340797; PRICE_PER: 0.035
CN3 = CONNECTORs:SFV15R-1STE1HLF: 15 Position FFC, FPC Connector Contacts, Bottom 0.020" (0.50mm) Surface Mount, Right Angle; DIGIKEY: 609-4311-1-ND; HEIGHT: 1.8; PRICE_PER: 0.46
CN4 CN7 = CONNECTORs:SFV8R-1STBE1HLF: 8 Position FFC, FPC Connector Contacts, Bottom 0.020" (0.50mm) Surface Mount, Right Angle; DIGIKEY: 609-SFV8R-1STBE1HLFCT-ND; HEIGHT: 1.8; PRICE_PER: 0.29
CN5 = CONNECTORs:NEB-21-R: Generic 2.1mm DC jack.; FARNELL: CN14789
CN6 = CONNECTORs:S4B-XH-SM4-TB
D1 D2 = DIODES:B360A-13-F: Schottky Rectifier, 60 V, 3 A, Single, DO-214AC, 2 Pins, 700 mV; DIGIKEY: B360A-FDICT-ND; HEIGHT: 2; PRICE_PER: 0.31
D3 = DIODES:SMBJ12CA-13-F: 19.9V Clamp 30.2A Ipp Tvs Diode Surface Mount SMB; DIGIKEY: SMBJ12CA-FDICT-ND; HEIGHT: 2.5; PRICE_PER: 0.29
D4 = DIODES:BZT52C10T-7: Zener Single Diode, 10 V, 300 mW, SOD-523, 2, 150 °C; DIGIKEY: BZT52C10T-7DICT-ND; HEIGHT: 1; PRICE_PER: 0.16
D5-D8 D10 = OPTO:150060RS75000: Red 625nm LED Indication - Discrete 2V 0603 (1608 Metric); DIGIKEY: 732-4978-1-ND; HEIGHT: 1; PRICE_PER: 0.11
FB3 = INDUCTORS:ILB1206ER151V: Ferrite bead, 100MHz, 150R, 0.8A, 1206; DIGIKEY: 541-2281-1-ND; HEIGHT: 1.5; PRICE_PER: 0.14
L1 = INDUCTORS:MWSA1004S-150MT: 15uH ±20% 6.5A 7A SMD Power Inductors ROHS; HEIGHT: 4; LCSC: C151872; PRICE_PER: 0.15
L2 = INDUCTORS:SRN5040-2R2Y: 2.2 µH Semi-Shielded Drum Core, Wirewound Inductor 3.5 A 21mOhm Max Nonstandard; DIGIKEY: SRN5040-2R2YCT-ND; HEIGHT: 4; PRICE_PER: 0.46
L3 = INDUCTORS:CIGT252010EH1R0MNE: 1 µH Unshielded Thin Film Inductor 4.1 A 30mOhm Max 1008 (2520 Metric) -; DIGIKEY: 1276-6929-1-ND; HEIGHT: 1; PRICE_PER: 0.19
MECH1-MECH4 = MISC:MOUNTHOLE: Mechanical mounting hole.
OSC1 = CRYSTALS:KC2016Z33.0000C15XXK: 33 MHz XO (Standard) CMOS Oscillator 1.71V ~ 3.63V Standby (Power Down) 4-SMD, No Lead; DIGIKEY: 478-KC2016Z33.0000C15XXKCT-ND; HEIGHT: 0.8; PRICE_PER: 0.98
Q1 = TRANSISTORs:GSFP0449: P-Channel 40 V 50A (Tc) 82W (Tc) Surface Mount 8-PPAK (5.1x5.71); DIGIKEY: 4786-GSFP0449CT-ND; HEIGHT: 2; PRICE_PER: 0.49
R1 R5 R19 = r_0603:CRCW060310K0FKTA: 10000 ±1% 10k Thick Film 0.1W, 1/10W 0603; DIGIKEY: 541-2980-1-ND; HEIGHT: 1; MANUFACTURER: Vishay Dale; POWER: 0.1W, 1/10W; PRICE_PER: 0.12000; STOCK: 50797; TOLERANCE: ±1%
R2 = RESISTORS:CRCW060351K0FKEA: 51000 51k0 0603 0.1W 1% thick film resistor.; FARNELL: 1469822; HEIGHT: 0.5; PRICE_PER: 0.0095
R3 R7-R9 R20 R21 R126 R130 R137-R147 = r_0603:ERJ3EKF1002V: 10000 10k 0603 0.1W 1% thick film resistor.; DIGIKEY: P10.0KHCT-ND; PRICE_PER: 0.10000
R4 = r_0603:CRCW0603100KFKEB: 100000 ±1% 100k Thick Film 0.1W, 1/10W 0603; DIGIKEY: 541-2972-1-ND; HEIGHT: 1; MANUFACTURER: Vishay Dale; POWER: 0.1W, 1/10W; PRICE_PER: 0.07000; STOCK: 201; TOLERANCE: ±1%
R6 = RESISTORS:CRCW060312K0FKEA: 12000 12k0 0603 0.1W 1% thick film resistor.; FARNELL: 1652834; HEIGHT: 0.5; PRICE_PER: 0.0095
R10-R14 R59 = r_0603:CRCW06032K20FKEA: 2200 ±1% 2.2k Thick Film 0.1W, 1/10W 0603; DIGIKEY: 541-2.20KHCT-ND; HEIGHT: 1; MANUFACTURER: Vishay Dale; POWER: 0.1W, 1/10W; PRICE_PER: 0.07000; STOCK: 11825; TOLERANCE: ±1%
R15 = r_0603:CRCW06035K23FKEA: 5230 ±1% 5.23k Thick Film 0.1W, 1/10W 0603; DIGIKEY: 541-5.23KHCT-ND; HEIGHT: 1; MANUFACTURER: Vishay Dale; POWER: 0.1W, 1/10W; PRICE_PER: 0.07000; STOCK: 1304; TOLERANCE: ±1%
R16 R17 = RESISTORS:CRL0603-FW-R330ELF: 0.33 0.33R 0603 0.1W 1% thick film resistor.; FARNELL: 2328096; HEIGHT: 0.5; PRICE_PER: 0.141
R18 = r_0603:CRCW060334K0FKEA: 34000 ±1% 34k Thick Film 0.1W, 1/10W 0603; DIGIKEY: 541-34.0KHCT-ND; HEIGHT: 1; MANUFACTURER: Vishay Dale; POWER: 0.1W, 1/10W; PRICE_PER: 0.07000; STOCK: 19900; TOLERANCE: ±1%
R148 R149 = r_0603:CRCW0603180KFKEA: 180000 ±1% 180k Thick Film 0.1W, 1/10W 0603; DIGIKEY: 541-180KHCT-ND; HEIGHT: 1; MANUFACTURER: Vishay Dale; POWER: 0.1W, 1/10W; PRICE_PER: 0.07000; STOCK: 3930; TOLERANCE: ±1%
SW1 = ELECTROMECH:PBH2UEESNPNAGX: Pushbutton Switch DPDT Standard Through Hole, Right Angle, Latching; DIGIKEY: EG5925-ND; HEIGHT: 10; PRICE_PER: 0.63
U1 = ICs:TPS54302: 4.5-V to 28-V Input, 3-A Output, EMI-Friendly Synchronous Step-Down Converter; DIGIKEY: 296-46237-1-ND; HEIGHT: 1; PRICE_PER: 1.27
U2 = ICs:USBLC6-2SC6: Very low capacitance ESD protection; DIGIKEY: 497-11882-1-ND; HEIGHT: 1.5; PRICE_PER: 0.38
U3 = ICs:93LC56: 2K Microwire Compatible Serial EEPROM [A = 256 x 8bit] [B = 128 x 16bit] 'B' for FT232H; DIGIKEY: 93LC56B-I/SN-ND; HEIGHT: 2; PRICE_PER: 0.26
U4 = ICs:W25Q128JV: FLASH - NOR Memory IC 128Mb (16M x 8) SPI - Quad I/O, QPI, DTR 133 MHz 8-SOIC; DIGIKEY: W25Q128JVSIQ-ND; HEIGHT: 2; PRICE_PER: 1.53
U5 = ICs:TPS62065: DC-DC Switching Buck Step Down Regulator, Adjustable, 2.9V-6Vin, 800mV-6Vout, 2Aout, WSON-8; DIGIKEY: 296-39441-1-ND; HEIGHT: 1; PRICE_PER: 1.60
U6 = ICs:FT2232H: FT2232H Dual High Speed USB to Multipurpose UART/FIFO IC; DIGIKEY: 768-1025-1-ND; HEIGHT: 2; PRICE_PER: 4.29
U7 = ICs:TPS563201: 4.5-V to 17-V Input, 3-A Synchronous Step-Down Voltage Regulator in SOT-23; DIGIKEY: 296-47238-1-ND; HEIGHT: 1; PRICE_PER: 0.39
U18 = ICs:T8Q144C4: Trion® Field Programmable Gate Array (FPGA) IC 97 125952 7384 144-LQFP; DIGIKEY: 2134-T8Q144C4-ND; HEIGHT: 2; PRICE_PER: 5.16
U23 = ICs:TMC2208-LA-T: TMC2202, TMC2208, TMC2224 Step/Dir Drivers for Two-Phase Bipolar Stepper Motors up to 2A peak - StealthChop™ for Quiet Movement - UART Interface Option.; DIGIKEY: 175-TMC2208-LA-TCT-ND; HEIGHT: 1; PRICE_PER: 2.65
XTAL2 = CRYSTALS:ABM8-12.000MHZ-B2-T: Small SMD Crystal, 12MHz.; DIGIKEY: 535-9826-1-ND; HEIGHT: 1.5; PRICE_PER: 0.56